# Altium project STB_LightBoard.PrjPcb (part 3 of 10)

## Sheet STB_Driver_ISL78171.SchDoc: STB Light Board - Driver
size A4; Author: flmoll; DrawnBy: flmoll; Organization: PBL; Revision: A; SheetNumber: 4; SheetTotal: 21
Used 28 times, as channels LG/D26, LIR1/D15, LIR1/D16, LIR1/D17, LIR1/D18, LIR2/D19, LIR2/D20, LIR3/D21, LIR3/D22, LIR3/D23, LIR3/D24, LW2/D10, LW2/D11, LW2/D12, LW2/D13, LW2/D14, LW1/D0, LW1/D1, LW1/D2, LW1/D3, LW1/D5, LW1/D6, LW1/D7, LW1/D4, LW1/D9, LW1/D8, LR/D27, LB/D25. Parts and nets are listed once, with the designators drawn on the sheet.
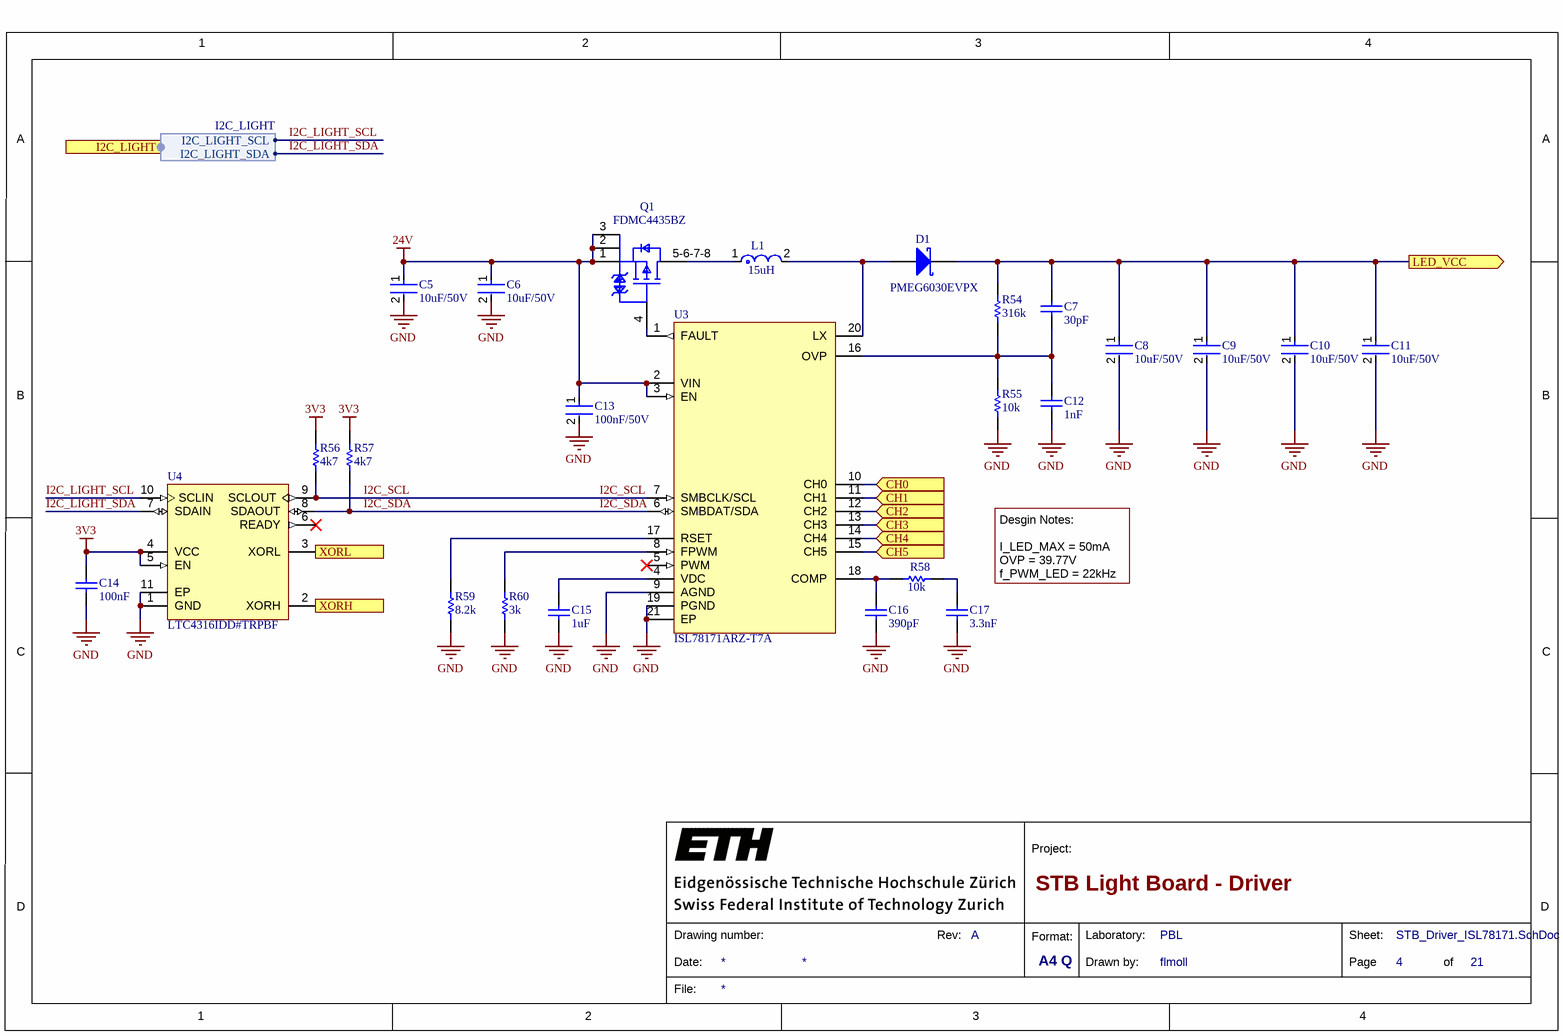
[diagram p4: STB_Driver_ISL78171.SchDoc]

### Parts
C5  10uF/50V  [FP-CL31B106KBHNNNE-MFG]
C6  10uF/50V  [FP-CL31B106KBHNNNE-MFG]
C7  30pF  [CAPC1005X56X25LL10T15]
C8  10uF/50V  [FP-CL31B106KBHNNNE-MFG]
C9  10uF/50V  [FP-CL31B106KBHNNNE-MFG]
C10  10uF/50V  [FP-CL31B106KBHNNNE-MFG]
C11  10uF/50V  [FP-CL31B106KBHNNNE-MFG]
C12  1nF  [CAPC1005X55X25LL5T10]
C13  100nF/50V  [FP-CL10-0_1-MFG]
C14  100nF  [CAPC1050X55X23LL05T13]
C15  1uF  [CAPC1608X90X35LL15T15]
C16  390pF  [CAPC1005X56X25LL10T15]
C17  3.3nF  [CAPC1005X56X25LL10T15]
D1  PMEG6030EVPX  [SOD-128]
L1  15uH  [FP-XAL6060-MFG]
Q1  FDMC4435BZ  [FP-511DQ-MFG]
R54  316k  [RESC1005X40X25LL05T05]
R55  10k  [RESC1005X40X25LL05T05]
R56  4k7  [RESC1005X40X25LL05T10]
R57  4k7  [RESC1005X40X25LL05T10]
R58  10k  [RESC1005X40X25LL05T05]
R59  8.2k  [RESC1005X40X25LL05T05]
R60  3k  [RESC1005X40X25LL05T10]
U3  ISL78171ARZ-T7A  [LT-UDC-20_N]
U4  LTC4316IDD#TRPBF  [DFN10(3x3)_N]

### Ports
CH0 (in, see LED_Driver_NF2W757GT-F1[2A]), CH1 (in, see LED_Driver_NF2W757GT-F1[2A]), CH2 (in, see LED_Driver_NF2W757GT-F1[2A]), CH3 (in, see LED_Driver_NF2W757GT-F1[2B]), CH4 (in, see LED_Driver_NF2W757GT-F1[2B]), CH5 (in, see LED_Driver_NF2W757GT-F1[2B]), I2C_LIGHT (harness I2C_LIGHT, see LED_Driver_NF2W757GT-F1[1A], LED_Driver_AREM-80C0[1A], LED_Driver_AREM-90C0[1A], LED_Driver_NE2B757GT[2B], LED_Driver_NE2G757GT[2B], LED_Driver_NE2R757GT-P6[2B], LED_Driver_NF2L757GT-F1[1A], LED_Driver_NF2W757GT-F1[1A], LED_Driver_QBHP686[1A], STB_FanControl[1A], STB_UID[1A]), LED_VCC (out, see LED_Driver_NF2W757GT-F1[2A]), XORH (see LED_Driver_NF2W757GT-F1[1B]), XORL (see LED_Driver_NF2W757GT-F1[1A])

### Harnesses
I2C_LIGHT: I2C_LIGHT_SDA, I2C_LIGHT_SCL

### Nets
3V3: C14.2 R56.2 R57.2 U4.4(VCC) U4.5(EN)
24V: C5.1 C6.1 C13.1 Q1.1(S) Q1.2(S) Q1.3(S) U3.2(VIN) U3.3(EN)
GND: C5.2 C6.2 C8.2 C9.2 C10.2 C11.2 C12.1 C13.2 C14.1 C15.1 C16.1 C17.1 R55.2 R59.1 R60.1 U3.9(AGND) U3.19(PGND) U3.21(EP) U4.1(GND) U4.11(EP)
CH0: U3.10(CH0) ; port CH0
CH1: U3.11(CH1) ; port CH1
CH2: U3.12(CH2) ; port CH2
CH3: U3.13(CH3) ; port CH3
CH4: U3.14(CH4) ; port CH4
CH5: U3.15(CH5) ; port CH5
I2C_LIGHT_SCL: U4.10(SCLIN) ; port I2C_LIGHT.I2C_LIGHT_SCL
I2C_LIGHT_SDA: U4.7(SDAIN) ; port I2C_LIGHT.I2C_LIGHT_SDA
I2C_SCL: R56.1 U3.7(SMBCLK/SCL) U4.9(SCLOUT)
I2C_SDA: R57.1 U3.6(SMBDAT/SDA) U4.8(SDAOUT)
LED_VCC: C7.2 C8.1 C9.1 C10.1 C11.1 D1.1(K) R54.2 ; port LED_VCC
XORH: U4.2(XORH) ; port XORH
XORL: U4.3(XORL) ; port XORL
NetC7_1: C7.1 C12.2 R54.1 R55.1 U3.16(OVP)
NetC15_2: C15.2 U3.4(VDC)
NetC16_2: C16.2 R58.2 U3.18(COMP)
NetC17_2: C17.2 R58.1
NetD1_2: D1.2(A) L1.2 U3.20(LX)
NetL1_1: L1.1 Q1.5-6-7-8(D)
NetQ1_4: Q1.4(G) U3.1(FAULT)
NetR59_2: R59.2 U3.17(RSET)
NetR60_2: R60.2 U3.8(FPWM)

Not connected (* = marked no-connect by the designer): U3 5(PWM)*; U4 6(READY)*

### Channels
LG/D26: designators end in _D26; ports CH0=NetLED89_g_10_1 CH1=NetLED89_g_11_1 CH2=NetLED89_g_12_1 CH3=NetLED89_g_13_1 CH4=NetLED89_g_14_1 CH5=NetLED89_g_15_1 LED_VCC=NetC7_D26_2 XORH=NetR87_1 XORL=NetR85_1
LIR1/D15: designators end in _D15; ports CH0=NetLED64_IR740_10_1 CH1=NetLED64_IR740_11_1 CH2=NetLED64_IR740_12_1 CH3=NetLED64_IR740_13_1 CH4=NetLED64_IR740_14_1 CH5=NetLED64_IR740_15_1 LED_VCC=NetC7_D15_2 XORH=GND XORL=NetR2_1
LIR1/D16: designators end in _D16; ports CH0=NetLED64_IR740_20_1 CH1=NetLED64_IR740_21_1 CH2=NetLED64_IR740_22_1 CH3=NetLED64_IR740_23_1 CH4=NetLED64_IR740_24_1 CH5=NetLED64_IR740_25_1 LED_VCC=NetC7_D16_2 XORH=NetR7_1 XORL=GND
LIR1/D17: designators end in _D17; ports CH0=NetLED64_IR740_30_1 CH1=NetLED64_IR740_31_1 CH2=NetLED64_IR740_32_1 CH3=NetLED64_IR740_33_1 CH4=NetLED64_IR740_34_1 CH5=NetLED64_IR740_35_1 LED_VCC=NetC7_D17_2 XORH=NetR8_1 XORL=NetR3_1
LIR1/D18: designators end in _D18; ports CH0=NetLED64_IR740_40_1 CH1=NetLED64_IR740_41_1 CH2=NetLED64_IR740_42_1 CH3=NetLED64_IR740_43_1 CH4=NetLED64_IR740_44_1 CH5=NetLED64_IR740_45_1 LED_VCC=NetC7_D18_2 XORH=NetR6_1 XORL=NetR1_1
LIR2/D19: designators end in _D19; ports CH0=NetLED129_IR850_10_1 CH1=NetLED129_IR850_11_1 CH2=NetLED129_IR850_12_1 CH3=NetLED129_IR850_13_1 CH4=NetLED129_IR850_14_1 CH5=NetLED129_IR850_15_1 LED_VCC=NetC7_D19_2 XORH=NetR65_1 XORL=NetR61_1
LIR2/D20: designators end in _D20; ports CH0=NetLED129_IR850_20_1 CH1=NetLED129_IR850_21_1 CH2=NetLED129_IR850_22_1 CH3=NetLED129_IR850_23_1 CH4=NetLED129_IR850_24_1 CH5=NetLED129_IR850_25_1 LED_VCC=NetC7_D20_2 XORH=NetR66_1 XORL=NetR62_1
LIR3/D21: designators end in _D21; ports CH0=NetLED41_IR940_10_1 CH1=NetLED41_IR940_11_1 CH2=NetLED41_IR940_12_1 CH3=NetLED41_IR940_13_1 CH4=NetLED41_IR940_14_1 CH5=NetLED41_IR940_15_1 LED_VCC=NetC7_D21_2 XORH=NetR78_1 XORL=NetR70_1
LIR3/D22: designators end in _D22; ports CH0=NetLED41_IR940_20_1 CH1=NetLED41_IR940_21_1 CH2=NetLED41_IR940_22_1 CH3=NetLED41_IR940_23_1 CH4=NetLED41_IR940_24_1 CH5=NetLED41_IR940_25_1 LED_VCC=NetC7_D22_2 XORH=NetR79_1 XORL=NetR71_1
LIR3/D23: designators end in _D23; ports CH0=NetLED41_IR940_30_1 CH1=NetLED41_IR940_31_1 CH2=NetLED41_IR940_32_1 CH3=NetLED41_IR940_33_1 CH4=NetLED41_IR940_34_1 CH5=NetLED41_IR940_35_1 LED_VCC=NetC7_D23_2 XORH=NetR80_1 XORL=NetR72_1
LIR3/D24: designators end in _D24; ports CH0=NetLED41_IR940_40_1 CH1=NetLED41_IR940_41_1 CH2=NetLED41_IR940_42_1 CH3=NetLED41_IR940_43_1 CH4=NetLED41_IR940_44_1 CH5=NetLED41_IR940_45_1 LED_VCC=NetC7_D24_2 XORH=NetR77_1 XORL=NetR69_1
LW2/D10: designators end in _D10; ports CH0=NetLED103_W3_10_1 CH1=NetLED103_W3_11_1 CH2=NetLED103_W3_12_1 CH3=NetLED103_W3_13_1 CH4=NetLED103_W3_14_1 CH5=NetLED103_W3_15_1 LED_VCC=NetC7_D10_2 XORH=GND XORL=NetR13_1
LW2/D11: designators end in _D11; ports CH0=NetLED103_W3_20_1 CH1=NetLED103_W3_21_1 CH2=NetLED103_W3_22_1 CH3=NetLED103_W3_23_1 CH4=NetLED103_W3_24_1 CH5=NetLED103_W3_25_1 LED_VCC=NetC7_D11_2 XORH=GND XORL=NetR14_1
LW2/D12: designators end in _D12; ports CH0=NetLED103_W3_30_1 CH1=NetLED103_W3_31_1 CH2=NetLED103_W3_32_1 CH3=NetLED103_W3_33_1 CH4=NetLED103_W3_34_1 CH5=NetLED103_W3_35_1 LED_VCC=NetC7_D12_2 XORH=GND XORL=NetR15_1
LW2/D13: designators end in _D13; ports CH0=NetLED103_W3_40_1 CH1=NetLED103_W3_41_1 CH2=NetLED103_W3_42_1 CH3=NetLED103_W3_43_1 CH4=NetLED103_W3_44_1 CH5=NetLED103_W3_45_1 LED_VCC=NetC7_D13_2 XORH=GND XORL=NetR12_1
LW2/D14: designators end in _D14; ports CH0=NetLED103_W3_50_1 CH1=NetLED103_W3_51_1 CH2=NetLED103_W3_52_1 CH3=NetLED103_W3_53_1 CH4=NetLED103_W3_54_1 CH5=NetLED103_W3_55_1 LED_VCC=NetC7_D14_2 XORH=GND XORL=NetR20_1
LW1/D0: designators end in _D0; ports CH0=NetLED77_W5_10_1 CH1=NetLED77_W5_11_1 CH2=NetLED77_W5_12_1 CH3=NetLED77_W5_13_1 CH4=NetLED77_W5_14_1 CH5=NetLED77_W5_15_1 LED_VCC=NetC7_D0_2 XORH=GND XORL=GND
LW1/D1: designators end in _D1; ports CH0=NetLED77_W5_20_1 CH1=NetLED77_W5_21_1 CH2=NetLED77_W5_22_1 CH3=NetLED77_W5_23_1 CH4=NetLED77_W5_24_1 CH5=NetLED77_W5_25_1 LED_VCC=NetC7_D1_2 XORH=GND XORL=NetR23_1
LW1/D2: designators end in _D2; ports CH0=NetLED77_W5_30_1 CH1=NetLED77_W5_31_1 CH2=NetLED77_W5_32_1 CH3=NetLED77_W5_33_1 CH4=NetLED77_W5_34_1 CH5=NetLED77_W5_35_1 LED_VCC=NetC7_D2_2 XORH=GND XORL=NetR24_1
LW1/D3: designators end in _D3; ports CH0=NetLED77_W5_40_1 CH1=NetLED77_W5_41_1 CH2=NetLED77_W5_42_1 CH3=NetLED77_W5_43_1 CH4=NetLED77_W5_44_1 CH5=NetLED77_W5_45_1 LED_VCC=NetC7_D3_2 XORH=GND XORL=NetR22_1
LW1/D5: designators end in _D5; ports CH0=NetLED77_W5_60_1 CH1=NetLED77_W5_61_1 CH2=NetLED77_W5_62_1 CH3=NetLED77_W5_63_1 CH4=NetLED77_W5_64_1 CH5=NetLED77_W5_65_1 LED_VCC=NetC7_D5_2 XORH=GND XORL=NetR30_1
LW1/D6: designators end in _D6; ports CH0=NetLED77_W5_70_1 CH1=NetLED77_W5_71_1 CH2=NetLED77_W5_72_1 CH3=NetLED77_W5_73_1 CH4=NetLED77_W5_74_1 CH5=NetLED77_W5_75_1 LED_VCC=NetC7_D6_2 XORH=GND XORL=NetR31_1
LW1/D7: designators end in _D7; ports CH0=NetLED77_W5_80_1 CH1=NetLED77_W5_81_1 CH2=NetLED77_W5_82_1 CH3=NetLED77_W5_83_1 CH4=NetLED77_W5_84_1 CH5=NetLED77_W5_85_1 LED_VCC=NetC7_D7_2 XORH=GND XORL=NetR28_1
LW1/D4: designators end in _D4; ports CH0=NetLED77_W5_50_1 CH1=NetLED77_W5_51_1 CH2=NetLED77_W5_52_1 CH3=NetLED77_W5_53_1 CH4=NetLED77_W5_54_1 CH5=NetLED77_W5_55_1 LED_VCC=NetC7_D4_2 XORH=GND XORL=NetR29_1
LW1/D9: designators end in _D9; ports CH0=NetLED77_W5_A0_1 CH1=NetLED77_W5_A1_1 CH2=NetLED77_W5_A2_1 CH3=NetLED77_W5_A3_1 CH4=NetLED77_W5_A4_1 CH5=NetLED77_W5_A5_1 LED_VCC=NetC7_D9_2 XORH=GND XORL=NetR37_1
LW1/D8: designators end in _D8; ports CH0=NetLED77_W5_90_1 CH1=NetLED77_W5_91_1 CH2=NetLED77_W5_92_1 CH3=NetLED77_W5_93_1 CH4=NetLED77_W5_94_1 CH5=NetLED77_W5_95_1 LED_VCC=NetC7_D8_2 XORH=GND XORL=NetR36_1
LR/D27: designators end in _D27; ports CH0=NetLED134_r_10_1 CH1=NetLED134_r_11_1 CH2=NetLED134_r_12_1 CH3=NetLED134_r_13_1 CH4=NetLED134_r_14_1 CH5=NetLED134_r_15_1 LED_VCC=NetC7_D27_2 XORH=NetR91_1 XORL=NetR89_1
LB/D25: designators end in _D25; ports CH0=NetLED148_b_10_1 CH1=NetLED148_b_11_1 CH2=NetLED148_b_12_1 CH3=NetLED148_b_13_1 CH4=NetLED148_b_14_1 CH5=NetLED148_b_15_1 LED_VCC=NetC7_D25_2 XORH=NetR42_1 XORL=NetR40_1

### Notes on the sheet
- Desgin Notes:
  I_LED_MAX = 50mA
  OVP = 39.77V
  f_PWM_LED = 22kHz
- 1
- 2
- 3
- 4
- A
- B
- C
- Project:
- D
- Date:
- Drawing number:
- Rev:
- Format:
- A4 Q
- Drawn by:
- Laboratory:
- Page
- Sheet:
- of
- File:

### Library data of the parts
C5 C6 C8-C11 = CMP-2000-07530-2: CAP CER 10UF 50V X7R 1206; Manufacturer: Samsung; Manufacturer Part Number: CL31B106KBHNNNE; Tolerance: 10%; Material: Ceramic; Temperature Coefficient: 15%; Multilayer: Yes; Temperature Characteristic: X7R; Digikey Description: CAP CER 10UF 50V X7R 1206; Device Class L1: Passive Components; Value: 10uF; Lead Free: Yes; Device Class L3: Ceramic Capacitors; Octopart: https://octopart.com/cl31b106kbhnnne-samsung-30507377; ComponentLink2URL: http://www.samsungsem.com/global/front/downloadcms.do?path=%2F%2Fglobal%2F%2Fsupport%2F%2Fproduct-search%2F%2Fmlcc%2F%2F__icsFiles%2F%2Fafieldfile%2F%2F2019%2F%2F06%2F%2F18&fileName=CL31B106KBHNNNE-19.pdf; Voltage Rating: 50V; Temperature Range Low: -55°C; RoHS: TRUE; Temperature: -55°C to +125°C; Category: Cap; ComponentLink2Description: Datasheet; Automotive: No; Device Class L2: Capacitors; Capacitance: 10uF; Height: 1.8mm; Temperature Range High: +125°C; Package: CL31B106KBHNNNE; Supplier 1: Digi-Key; Supplier Part Number 1: 1276-6767-6-ND; Stock 1: 1900998; Pricing 1: 1=0.33000, 10=0.22700, 50=0.15920, 100=0.13650, 500=0.10236, 1000=0.08643 (USD); Mount: Surface Mount; Number of Pins: 2; Dielectric Material: Ceramic; Terminal Finish: Nickel; Size Code: 1206; Package Shape: Rectangular; Min Operating Temperature: -55°C; Max Operating Temperature: 125°C; Capacitor Type: Ceramic; Negative Tolerance: 10%; Positive Tolerance: 10%; Rated DC Voltage (URdc): 50V; Termination: Wraparound; Package Style: SMTMeter; Packaging: Tape and Reel; JESD-609 Code: e3; Temperature Characteristics Code: X7R; Length: 3.2mm; Width: 1.6mm; REACH SVHC: Yes; RoHS Compliant: Yes; ComponentLink1URL: https://datasheet.ciiva.com:443/pdfs/VipMasterIC/IC/SEMS/SEMS-S-A0008524842/SEMS-S-A0008524770-1.pdf?src-supplier=IHS+Markit; ComponentLink1Description: https://datasheet.ciiva.com:443/pdfs/VipMasterIC/IC/SEMS/SEMS-S-A0008524842/SEMS-S-A0008524770-1.pdf?src-supplier=IHS+Markit; ComponentLink3URL: http://www.samsungsem.com/kr/support/product-search/mlcc/CL31B106KBHNNNE.jsp?src-supplier=Digi-Key; ComponentLink3Description: http://www.samsungsem.com/kr/support/product-search/mlcc/CL31B106KBHNNNE.jsp?src-supplier=Digi-Key
C7 = CMP-2008-02634-1: Part Number: 04025A300JAT2A; Manufacturer: AVX Interconnect / Elco; Dielectric Material: Ceramic; Multilayer: Yes; Negative Tolerance: 5%; Rated DC Voltage (URdc): 50V; Temperature Characteristics Code: C0G; Supplier 1: Digi-Key; Supplier Part Number 1: 478-10097-1-ND; Manufacturer Part Number: 04025A300JAT2A; RoHS: Yes; Category: Ceramic Capacitors; Stock 1: 53990; Pricing 1: 1=0.22000, 10=0.15200, 50=0.09080, 100=0.07680, 500=0.05252, 1000=0.04646, 2500=0.04444, 5000=0.04040 (USD); Mount: Surface Mount; Number of Pins: 2; Size Code: 0402; Terminal Finish: Nickel; Package Shape: Rectangular; Min Operating Temperature: -55°C; Max Operating Temperature: 125°C; JESD-609 Code: e3; Value: 30 pF; Capacitor Type: Ceramic; Packaging: Tape and Reel; Positive Tolerance: 5%; Termination: Wraparound; Reach SVHC Compliant: Yes; RoHS Compliant: Yes; ComponentLink1URL: https://datasheet.ciiva.com:443/pdfs/VipMasterIC/IC/AVXC/AVXCS07796/AVXCS07796-1.pdf?src-supplier=IHS+Markit; ComponentLink1Description: https://datasheet.ciiva.com:443/pdfs/VipMasterIC/IC/AVXC/AVXCS07796/AVXCS07796-1.pdf?src-supplier=IHS+Markit; ComponentLink2URL: https://datasheet.ciiva.com/205/ccog-205474.pdf?src-supplier=Digi-Key; ComponentLink2Description: https://datasheet.ciiva.com/205/ccog-205474.pdf?src-supplier=Digi-Key; ComponentLink3URL: https://datasheet.ciiva.com/5424/ccog-243403-5424903.pdf?src-supplier=Mouser; ComponentLink3Description: https://datasheet.ciiva.com/5424/ccog-243403-5424903.pdf?src-supplier=Mouser
C12 = CMP-1662-00017-1: Chip Capacitor, 1 nF, +/- 10%, 50 V, -55 to 125 degC, 0402 (1005 Metric), RoHS, Tape and Reel; Manufacturer: Murata; Manufacturer Part Number: GRM155R71H102KA01D; Case\/Package: 0402; Type (Capacitors): X7R; Voltage Rating (DC): 50 V; Dielectric Material: Ceramic; Multilayer: Yes; Rated DC Voltage (URdc): 50V; Width: 0.5 mm; Pins: 2; REACH SVHC: No SVHC; Length: 1 mm; Height: 0.5 mm; PackageDescription: 2-Pin Surface Mount Device, Body 1 x 0.5 mm; DatasheetVersion: 07/2016; Mount: Surface Mount; ComponentLink2Description: Datasheet; Tolerance: 10%; ComponentLink2URL: http://psearch.en.murata.com/capacitor/product/GRM155R71H102KA01%23.pdf; ComponentLink1URL: http://www.murata.com/; Case Code (Metric): 1005; Package Quantity: 10000; Min Operating Temperature: -55 degC; Max Operating Temperature: 125 degC; Value: 1 nF; Voltage Rating: 50 V; ComponentLink1Description: Manufacturer URL; Packaging: Tape and Reel; Radiation Hardening: No; RoHSCompliant: true; PackageReference: 0402; Mounting Technology: Surface Mount; Case Code (Imperial): 0402; Supplier 1: Digi-Key; Supplier Part Number 1: 490-1303-6-ND; RoHS: Yes; Category: Ceramic Capacitors; Stock 1: 9070370; Pricing 1: 1=0.10000, 10=0.01800, 50=0.01000, 100=0.00810, 500=0.00578, 1000=0.00454, 2500=0.00412, 5000=0.00380 (USD); Number of Pins: 2; Package Shape: Rectangular; Size Code: 0402; Terminal Finish: Nickel; JESD-609 Code: e3; Capacitor Type: Ceramic; Negative Tolerance: 10%; Package Style: SMTMeter; Positive Tolerance: 10%; Temperature Characteristics Code: X7R; Termination: Wraparound; Reach SVHC Compliant: Yes; RoHS Compliant: Yes; ComponentLink3URL: https://datasheet.ciiva.com:443/pdfs/VipMasterIC/IC/MURE/MURE-S-A0008911154/MURE-S-A0008911121-1.pdf?src-supplier=IHS+Markit; ComponentLink3Description: https://datasheet.ciiva.com:443/pdfs/VipMasterIC/IC/MURE/MURE-S-A0008911154/MURE-S-A0008911121-1.pdf?src-supplier=IHS+Markit
C13 = CMP-13271-000011-1: CAP CER 0.1UF 50V X7R 0603; Manufacturer: Samsung Electro-Mechanics America, Inc; Manufacturer Part Number: CL10B104JB8NNNC; Value: 100nF; Material: Ceramic; Temperature Coefficient: 15%; Tolerance: 5%; Multilayer: Yes; Ipc Land Pattern Name: CAPC16080X80; Device Class L1: Passive Components; Digikey Description: CAP CER 0.1UF 50V X7R 0603; Voltage Rating: 50V; Height: 0.9mm; ComponentLink2Description: Datasheet; Device Class L2: Capacitors; ComponentLink2URL: http://www.samsungsem.com/kr/support/product-search/mlcc/__icsFiles/afieldfile/2019/06/18/CL10B104JB8NNNC-19.pdf; Temperature Characteristic: X7R; Temperature Range High: +125°C; Lead Free: Yes; Temperature Range Low: -55°C; Category: Cap; Package: CL10-0.1; Temperature: -55°C to +125°C; Octopart: https://octopart.com/cl10b104jb8nnnc-samsung-9302151; Device Class L3: Ceramic Capacitors; RoHS: TRUE; Automotive: No; Capacitance: 100nF; Supplier 1: Digi-Key; Supplier Part Number 1: 1276-1033-1-ND; Stock 1: 1084419; Pricing 1: 1=0.10000, 10=0.03900, 50=0.02120, 100=0.01740, 500=0.01240, 1000=0.00975 (USD); Mount: Surface Mount; Number of Pins: 2; Dielectric Material: Ceramic; Package Shape: Rectangular; Size Code: 0603; Terminal Finish: Nickel; Min Operating Temperature: -55°C; Max Operating Temperature: 125°C; JESD-609 Code: e3; Capacitor Type: Ceramic; Negative Tolerance: 5%; Package Style: SMTMeter; Packaging: Tape and Reel; Positive Tolerance: 5%; Rated DC Voltage (URdc): 50V; Temperature Characteristics Code: X7R; Termination: Wraparound; Length: 1.6mm; Width: 0.8mm; REACH SVHC: Yes; RoHS Compliant: Yes; ComponentLink1URL: https://datasheet.ciiva.com:443/pdfs/VipMasterIC/IC/SEMS/SEMS-S-A0008384515/SEMS-S-A0008873313-1.pdf?src-supplier=IHS+Markit; ComponentLink1Description: https://datasheet.ciiva.com:443/pdfs/VipMasterIC/IC/SEMS/SEMS-S-A0008384515/SEMS-S-A0008873313-1.pdf?src-supplier=IHS+Markit; ComponentLink3URL: https://datasheet.ciiva.com/25793/cl10b104jb8nnnc-25793394.pdf?src-supplier=Digi-Key; ComponentLink3Description: https://datasheet.ciiva.com/25793/cl10b104jb8nnnc-25793394.pdf?src-supplier=Digi-Key; ComponentLink4URL: https://datasheet.ciiva.com/16498/cl10b104jb8nnnc-16498485.pdf?src-supplier=Future+Electronics; ComponentLink4Description: https://datasheet.ciiva.com/16498/cl10b104jb8nnnc-16498485.pdf?src-supplier=Future+Electronics; ComponentLink5URL: https://datasheet.ciiva.com/26838/getdatasheetpartid-359321-26838402.pdf?src-supplier=Verical; ComponentLink5Description: https://datasheet.ciiva.com/26838/getdatasheetpartid-359321-26838402.pdf?src-supplier=Verical; ComponentLink6URL: https://datasheet.ciiva.com/29199/456613-da-01-en-vs-kondensator-0603-29199008.pdf?src-supplier=Conrad; ComponentLink6Description: https://datasheet.ciiva.com/29199/456613-da-01-en-vs-kondensator-0603-29199008.pdf?src-supplier=Conrad
C14 = CMP-2000-05439-1: Chip Capacitor, 100 nF, +/- 10%, 16 V, -55 to 125 degC, 0402 (1005 Metric), RoHS, Tape and Reel; Manufacturer: Samsung Electro-Mechanics; Manufacturer Part Number: CL05B104KO5NNNC; Dielectric: X7R; Rated Voltage: 16V; Dielectric Material: Ceramic; Multilayer: Yes; Case Size/Dimension: 0402; Tolerance (%): ±10%; Value: 100nF; Manufacturer URL: http://www.samsungsem.com/global/index.jsp; Datasheet URL: https://datasheet.ciiva.com/29198/458718-da-01-en-vs-kondensator-0402-29198423.pdf; Datasheet Version: Nov-10; Supplier 1: Digi-Key; Supplier Part Number 1: 1276-1001-6-ND; RoHS: Yes; Category: Ceramic Capacitors; Stock 1: 24854634; Pricing 1: 1=0.10000, 10=0.02400, 50=0.01300, 100=0.01050, 500=0.00752, 1000=0.00592, 2500=0.00538, 5000=0.00495 (USD); Mount: Surface Mount; Number of Pins: 2; Package Shape: Rectangular; Size Code: 0402; Terminal Finish: Nickel; Min Operating Temperature: -55°C; Max Operating Temperature: 125°C; JESD-609 Code: e3; Capacitor Type: Ceramic; Negative Tolerance: 10%; Packaging: Tape and Reel; Positive Tolerance: 10%; Rated DC Voltage (URdc): 16V; Temperature Characteristics Code: X7R; Termination: Wraparound; Package Style: SMTMeter; Length: 1mm; Width: 0.5mm; Height: 0.55mm; REACH SVHC: Yes; RoHS Compliant: Yes; ComponentLink1URL: https://datasheet.ciiva.com:443/pdfs/VipMasterIC/IC/SEMS/SEMS-S-A0008384515/SEMS-S-A0008872921-1.pdf?src-supplier=IHS+Markit; ComponentLink1Description: https://datasheet.ciiva.com:443/pdfs/VipMasterIC/IC/SEMS/SEMS-S-A0008384515/SEMS-S-A0008872921-1.pdf?src-supplier=IHS+Markit; ComponentLink2URL: https://datasheet.ciiva.com/26920/getdatasheetpartid-359683-26920169.pdf?src-supplier=Verical; ComponentLink2Description: https://datasheet.ciiva.com/26920/getdatasheetpartid-359683-26920169.pdf?src-supplier=Verical; ComponentLink3URL: https://datasheet.ciiva.com/29198/458718-da-01-en-vs-kondensator-0402-29198423.pdf?src-supplier=Conrad; ComponentLink3Description: https://datasheet.ciiva.com/29198/458718-da-01-en-vs-kondensator-0402-29198423.pdf?src-supplier=Conrad; ComponentLink4URL: https://datasheet.ciiva.com/26309/mlcc-catalogdownload2013-eng-26309003.pdf?src-supplier=Distrelec; ComponentLink4Description: https://datasheet.ciiva.com/26309/mlcc-catalogdownload2013-eng-26309003.pdf?src-supplier=Distrelec; ComponentLink5URL: https://datasheet.ciiva.com/16208/cl05b104kq5nnnc-16208343.pdf?src-supplier=Future+Electronics; ComponentLink5Description: https://datasheet.ciiva.com/16208/cl05b104kq5nnnc-16208343.pdf?src-supplier=Future+Electronics
C15 = CMP-2006-02298-2: Manufacturer: Kemet; Part Number: C0603C105K4RACTU; Dielectric Material: Ceramic; Multilayer: Yes; Negative Tolerance: 10%; Rated DC Voltage (URdc): 16V; Temperature Characteristics Code: X7R; Supplier 1: Digi-Key; Supplier Part Number 1: 399-C0603C105K4RAC7867DKR-ND; Manufacturer Part Number: C0603C105K4RACTU; RoHS: Yes; Category: Ceramic Capacitors; Stock 1: 1549593; Pricing 1: 1=0.10000, 10=0.07700, 50=0.04180, 100=0.03410, 500=0.02440, 1000=0.01916 (USD); Mount: Surface Mount; Number of Pins: 2; Package Shape: Rectangular; Size Code: 0603; Terminal Finish: Nickel; Min Operating Temperature: -55°C; Max Operating Temperature: 125°C; Value: 1uF; Capacitor Type: Ceramic; Packaging: Tape and Reel; Positive Tolerance: 10%; Termination: Wraparound; JESD-609 Code: e3; Package Style: SMTMeter; Length: 1.6mm; Width: 0.8mm; Height: 0.8mm; REACH SVHC: Yes; RoHS Compliant: Yes; ComponentLink1URL: https://datasheet.ciiva.com:443/pdfs/VipMasterIC/IC/KEME/KEME-S-A0008991654/KEME-S-A0008991654-1.pdf?src-supplier=IHS+Markit; ComponentLink1Description: https://datasheet.ciiva.com:443/pdfs/VipMasterIC/IC/KEME/KEME-S-A0008991654/KEME-S-A0008991654-1.pdf?src-supplier=IHS+Markit
C16 = CMP-2008-02723-1: Manufacturer: AVX Interconnect / Elco; Part Number: 04025C391JAT2A; Dielectric Material: Ceramic; Multilayer: Yes; Negative Tolerance: 5%; Rated DC Voltage (URdc): 50V; Temperature Characteristics Code: X7R; Supplier 1: Digi-Key; Supplier Part Number 1: 478-5269-6-ND; Manufacturer Part Number: 04025C391JAT2A; RoHS: Yes; Category: Ceramic Capacitors; Stock 1: 11766; Pricing 1: 1=0.34000, 10=0.23000, 50=0.15360, 100=0.13050, 500=0.09212, 1000=0.08060, 2500=0.07676, 5000=0.07100 (USD); Mount: Surface Mount; Number of Pins: 2; Size Code: 0402; Terminal Finish: Nickel; Package Shape: Rectangular; Min Operating Temperature: -55°C; Max Operating Temperature: 125°C; Value: 390pF; Capacitor Type: Ceramic; Positive Tolerance: 5%; Packaging: Tape and Reel; JESD-609 Code: e3; Package Style: SMTMeter; Termination: Wraparound; Length: 1mm; Width: 0.5mm; Height: 0.56mm; REACH SVHC: Yes; RoHS Compliant: Yes; ComponentLink1URL: https://datasheet.ciiva.com:443/pdfs/VipMasterIC/IC/AVXC/AVXC-S-A0008668650/AVXC-S-A0008668650-1.pdf?src-supplier=IHS+Markit; ComponentLink1Description: https://datasheet.ciiva.com:443/pdfs/VipMasterIC/IC/AVXC/AVXC-S-A0008668650/AVXC-S-A0008668650-1.pdf?src-supplier=IHS+Markit; ComponentLink2URL: https://datasheet.ciiva.com/152/cx7r-152296.pdf?src-supplier=Digi-Key; ComponentLink2Description: https://datasheet.ciiva.com/152/cx7r-152296.pdf?src-supplier=Digi-Key; ComponentLink3URL: https://datasheet.ciiva.com/152/cx7r-152297.pdf?src-supplier=Digi-Key; ComponentLink3Description: https://datasheet.ciiva.com/152/cx7r-152297.pdf?src-supplier=Digi-Key; ComponentLink4URL: https://datasheet.ciiva.com/152/cx7r-152298.pdf?src-supplier=Digi-Key; ComponentLink4Description: https://datasheet.ciiva.com/152/cx7r-152298.pdf?src-supplier=Digi-Key; ComponentLink5URL: https://datasheet.ciiva.com/16327/cx7r-16327679.pdf?src-supplier=Future+Electronics; ComponentLink5Description: https://datasheet.ciiva.com/16327/cx7r-16327679.pdf?src-supplier=Future+Electronics
C17 = CMP-2008-02533-1: Manufacturer: AVX Interconnect / Elco; Part Number: 04023C332KAT2A; Dielectric Material: Ceramic; Multilayer: Yes; Negative Tolerance: 10%; Rated DC Voltage (URdc): 25V; Temperature Characteristics Code: X7R; Supplier 1: Digi-Key; Supplier Part Number 1: 478-12621-6-ND; Manufacturer Part Number: 04023C332KAT2A; RoHS: Yes; Category: Ceramic Capacitors; Stock 1: 22877; Pricing 1: 1=0.10000, 10=0.03300, 50=0.01820, 100=0.01480, 500=0.01060, 1000=0.00833, 2500=0.00758, 5000=0.00697 (USD); Mount: Surface Mount; Number of Pins: 2; Package Shape: Rectangular; Size Code: 0402; Terminal Finish: Nickel; Min Operating Temperature: -55°C; Max Operating Temperature: 125°C; Value: 3.3nF; Capacitor Type: Ceramic; Packaging: Tape and Reel; Positive Tolerance: 10%; Termination: Wraparound; JESD-609 Code: e3; Package Style: SMTMeter; Length: 1mm; Width: 0.5mm; Height: 0.56mm; Reach SVHC Compliant: Yes; RoHS Compliant: Yes; ComponentLink1URL: https://datasheet.ciiva.com:443/pdfs/VipMasterIC/IC/AVXC/AVXC-S-A0009640452/AVXC-S-A0009640452-1.pdf?src-supplier=IHS+Markit; ComponentLink1Description: https://datasheet.ciiva.com:443/pdfs/VipMasterIC/IC/AVXC/AVXC-S-A0009640452/AVXC-S-A0009640452-1.pdf?src-supplier=IHS+Markit; ComponentLink2URL: https://datasheet.ciiva.com/206/cx7r-206442.pdf?src-supplier=Digi-Key; ComponentLink2Description: https://datasheet.ciiva.com/206/cx7r-206442.pdf?src-supplier=Digi-Key; ComponentLink3URL: https://datasheet.ciiva.com/11578/cx7r-11578284.pdf?src-supplier=Avnet; ComponentLink3Description: https://datasheet.ciiva.com/11578/cx7r-11578284.pdf?src-supplier=Avnet
D1 = CMP-02090-1: Diode Schottky 60 V 3A Surface Mount SOD-128/CFP5; Manufacturer: Nexperia; Application(s): EFFICIENCY; Diode Element Material: SILICON; Diode Type: RECTIFIER; Forward Voltage-Max (VF): 475mV; Max Output Current: 4.2A; Max Power Dissipation: 750mW; Max Reverse Current: 400uA; Non-rep Pk Forward Current-Max: 70A; Number of Elements: 1; Package Body Material: Plastic; Reference Standard: AEC-Q101; Rep Pk Reverse Voltage-Max: 60V; Reverse Recovery Time-Max: 0.02us; Description: Rectifier Diode, Schottky, 1 Phase, 1 Element, 4.2A, 60V V(RRM), Silicon; JESD-30 Code: R-PDSO-F2; Max Operating Temperature: 175°C; Min Operating Temperature: -55°C; Number of Phases: 1; Number of Pins: 2; Package Shape: Rectangular; Package Style: SMALL OUTLINEMeter; REACH SVHC: Yes; RoHS Compliant: Yes; Surface Mount: Yes; Technology: SCHOTTKY; Terminal Form: Flat; Terminal Position: DUAL; Supplier 1: Digi-Key; Supplier Part Number 1: 1727-1349-2-ND; Manufacturer Part Number: PMEG6030EVPX; RoHS: No; Category: Rectifier Diodes; Stock 1: 216000; Pricing 1: 3000=0.17153, 6000=0.16046, 15000=0.15660 (USD); Reach SVHC Compliant: No; ComponentLink1URL: https://datasheet.ciiva.com:443/pdfs/VipMasterIC/IC/NEXP/NEXP-S-A0003060256/NEXP-S-A0003060189-1.pdf?src-supplier=IHS+Markit; ComponentLink1Description: https://datasheet.ciiva.com:443/pdfs/VipMasterIC/IC/NEXP/NEXP-S-A0003060256/NEXP-S-A0003060189-1.pdf?src-supplier=IHS+Markit; ComponentLink2URL: http://www.farnell.com/datasheets/1738907.pdf?src-supplier=Farnell; ComponentLink2Description: http://www.farnell.com/datasheets/1738907.pdf?src-supplier=Farnell; ComponentLink3URL: http://www.farnell.com/datasheets/1738907.pdf?src-supplier=Newark; ComponentLink3Description: http://www.farnell.com/datasheets/1738907.pdf?src-supplier=Newark; ComponentLink4URL: https://assets.nexperia.com/documents/data-sheet/PMEG6030EVP.pdf?src-supplier=Digi-Key; ComponentLink4Description: https://assets.nexperia.com/documents/data-sheet/PMEG6030EVP.pdf?src-supplier=Digi-Key; ComponentLink5URL: http://www.farnell.com/datasheets/1738907.pdf?src-supplier=Element14; ComponentLink5Description: http://www.farnell.com/datasheets/1738907.pdf?src-supplier=Element14
L1 = CMP-11268-000180-1: Power inductor, shielded, 20% tol, SMT, RoHS, halogen, SMD2; Manufacturer: Coilcraft; Manufacturer Part Number: XAL6060-153MEC; Saturation Current: 5.8A; Max DC Current: 6A; Core Material: Composite; Self Resonant Frequency: 11MHz; Test Frequency: 100kHz; DC Resistance (DCR): 43.75mR; Case/Size Code: 2526; Inductor Type: GENERAL PURPOSE INDUCTOR; Number of Functions: 1; Shape/Size Description: RECTANGULAR PACKAGE; Package Height: 6.1mm; Package Length: 6.56mm; Package Width: 6.36mm; Reference Standard: AEC-Q200; Length: 6.76mm; Termination: SMD/SMT; RoHS Compliant: Yes; REACH SVHC: No SVHC; Lead Free: Contains Lead; Height: 6.1mm; Inductance Tolerance: 20%; Series: XAL6060; Package Quantity: 250; Min Operating Temperature: -40°C; Width: 6.56mm; Packaging: Tape and Reel; Inductance: 15uH; Case/Package: SMD/SMT; Max Operating Temperature: 125°C; Mount: Surface Mount; Shielding: Shielded; RMS Current (Irms): 6A; Tolerance: 20%; Supplier 1: Mouser; Supplier Part Number 1: 994-XAL6060-153MEC; RoHS: Yes; Category: Fixed Inductors; Stock 1: 38539; Pricing 1: 1=3.81000, 10=3.81000, 50=3.81000, 100=3.05000, 1000=1.36000, 10000=1.36000 (USD); Number of Pins: 2; Terminal Finish: Tin; JESD-609 Code: e2; Construction: Shielded; Value: 15uH; Inductor Application: POWER INDUCTOR; Package Style: SMTMeter; Rated Current-Max: 6A; Surface Mount: Yes; Terminal Placement: Dual Ended; ComponentLink1URL: https://datasheet.ciiva.com:443/pdfs/VipMasterIC/IC/COLC/COLC-S-A0006757260/COLC-S-A0006757260-1.pdf?src-supplier=IHS+Markit; ComponentLink1Description: https://datasheet.ciiva.com:443/pdfs/VipMasterIC/IC/COLC/COLC-S-A0006757260/COLC-S-A0006757260-1.pdf?src-supplier=IHS+Markit; ComponentLink2URL: https://datasheet.ciiva.com/22680/1681993-22680391.pdf?src-supplier=Element14; ComponentLink2Description: https://datasheet.ciiva.com/22680/1681993-22680391.pdf?src-supplier=Element14; ComponentLink3URL: https://datasheet.ciiva.com/22680/1681993-22680392.pdf?src-supplier=Element14; ComponentLink3Description: https://datasheet.ciiva.com/22680/1681993-22680392.pdf?src-supplier=Element14; ComponentLink4URL: https://datasheet.ciiva.com/22738/1681993-22738318.pdf?src-supplier=Element14; ComponentLink4Description: https://datasheet.ciiva.com/22738/1681993-22738318.pdf?src-supplier=Element14
Q1 = CMP-07173-000045-1: MOSFET P-CH 30V 8.5A POWER33; Manufacturer: ON Semiconductor; Reverse Recovery Charge: 12nC; Reverse Recovery Time: 26ns; Threshold Vgs Min: -1V; Continuous Drain Current: -8.5A; Threshold Vgs Max: -3V; Number Of Channels: 1; Drain To Source Resistance: 14mΩ; Gate Charge At Vgs: 38nC @ -10V; Rthja Max: 53°C/W; Typ Forward Diode Voltage: 0.86V; Turn Off Delay Time: 35ns; Max Forward Diode Voltage: 1.5V; Drain To Source Voltage: -30V; Pulse Drain Current: -50A; Turn On Delay Time: 10ns; Transconductance: 25S; Depletion Mode: False; Gate To Source Voltage: 25V; Standoff Height: 0mm; Max Junction Temp: +150°C; Input Capacitace At Vds: 1535pF @ -15V; Power Dissipation: 2.3W; Manufacturer Part Number: FDMC4435BZ; Footprint Url: https://www.onsemi.com/pub/Collateral/511DQ.PDF; Temperature Range High: +150°C; Device Class L2: Transistors; Mouser Description: MOSFET -30V P-Channel PowerTrench; Lead Free: Yes; Automotive: No; RoHS: TRUE; Temperature Range Low: -55°C; Category: Trans; Temperature: -55°C to +150°C; Digikey Description: MOSFET P-CH 30V 8.5A POWER33; Package: 511DQ; Drain To Source Breakdown Voltage: -30V; Number Of P Channels: 1; Device Class L3: MOSFETs; ComponentLink2URL: https://www.onsemi.com/pub/Collateral/FDMC4435BZ-D.PDF; ComponentLink2Description: Datasheet; Height: 0.8mm; Device Class L1: Discrete Semiconductors; Octopart: https://octopart.com/fdmc4435bz-on+semiconductor-84326033
R54 = CMP-2002-00863-1: Manufacturer: Panasonic; Part Number: ERJ-2RKF3163X; Tolerance: 1%; Rated Power Dissipation (P): 100mW; Value: 316 kOhm; Temperature Coefficient: 100ppm/°C; Working Voltage: 50V; Rated Temperature: 70°C; Package Height: 0.35mm; Package Length: 1mm; Package Width: 0.5mm; Reference Standard: AEC-Q200; Supplier 1: Digi-Key; Supplier Part Number 1: P316KLDKR-ND; Manufacturer Part Number: ERJ-2RKF3163X; RoHS: Yes; Category: Chip SMD Resistors; Stock 1: 215434; Pricing 1: 1=0.10000, 10=0.03300, 100=0.01330, 1000=0.00599, 2500=0.00520, 5000=0.00429 (USD); Mount: Surface Mount; Number of Pins: 2; Size Code: 0402; Terminal Finish: Nickel; Package Shape: Rectangular; Min Operating Temperature: -55°C; Max Operating Temperature: 155°C; Resistor Type: FIXED RESISTOR; Packaging: Tape and Reel; Technology: METAL GLAZE/THICK FILM; JESD-609 Code: e3; Construction: Rectangular; Package Style: SMTMeter; Termination: Wraparound; Reach SVHC Compliant: Yes; RoHS Compliant: Yes; ComponentLink1URL: https://datasheet.ciiva.com:443/pdfs/VipMasterIC/IC/PANA/PANA-S-A0009889626/PANA-S-A0009889626-1.pdf?src-supplier=IHS+Markit; ComponentLink1Description: https://datasheet.ciiva.com:443/pdfs/VipMasterIC/IC/PANA/PANA-S-A0009889626/PANA-S-A0009889626-1.pdf?src-supplier=IHS+Markit; ComponentLink2URL: https://datasheet.ciiva.com/7853/aoa0000ce2-7853694.pdf?src-supplier=Element14; ComponentLink2Description: https://datasheet.ciiva.com/7853/aoa0000ce2-7853694.pdf?src-supplier=Element14; ComponentLink3URL: https://datasheet.ciiva.com/43467/1678782-43467525.pdf?src-supplier=Farnell; ComponentLink3Description: https://datasheet.ciiva.com/43467/1678782-43467525.pdf?src-supplier=Farnell; ComponentLink4URL: https://datasheet.ciiva.com/46373/1678782-46373323.pdf?src-supplier=Element14; ComponentLink4Description: https://datasheet.ciiva.com/46373/1678782-46373323.pdf?src-supplier=Element14; ComponentLink5URL: https://datasheet.ciiva.com/22663/1678782-22663805.pdf?src-supplier=Farnell; ComponentLink5Description: https://datasheet.ciiva.com/22663/1678782-22663805.pdf?src-supplier=Farnell; ComponentLink6URL: https://datasheet.ciiva.com/28564/1694929-28564143.pdf?src-supplier=Element14; ComponentLink6Description: https://datasheet.ciiva.com/28564/1694929-28564143.pdf?src-supplier=Element14; ComponentLink7URL: https://datasheet.ciiva.com/46373/1678782-46373322.pdf?src-supplier=Element14; ComponentLink7Description: https://datasheet.ciiva.com/46373/1678782-46373322.pdf?src-supplier=Element14; ComponentLink8URL: https://datasheet.ciiva.com/24070/aoa0000ce2-24070773.pdf?src-supplier=Mouser; ComponentLink8Description: https://datasheet.ciiva.com/24070/aoa0000ce2-24070773.pdf?src-supplier=Mouser; ComponentLink9URL: https://datasheet.ciiva.com/16761/70260748-16761806.pdf?src-supplier=Allied+Electronics; ComponentLink9Description: https://datasheet.ciiva.com/16761/70260748-16761806.pdf?src-supplier=Allied+Electronics; ComponentLink10URL: https://datasheet.ciiva.com/16762/70260748-16762152.pdf?src-supplier=Allied+Electronics; ComponentLink10Description: https://datasheet.ciiva.com/16762/70260748-16762152.pdf?src-supplier=Allied+Electronics; ComponentLink11URL: https://datasheet.ciiva.com/9183/aoa0000ce2-9183095.pdf?src-supplier=Avnet; ComponentLink11Description: https://datasheet.ciiva.com/9183/aoa0000ce2-9183095.pdf?src-supplier=Avnet; ComponentLink12URL: https://datasheet.ciiva.com/30180/aoa0000ce2-30180486.pdf?src-supplier=Onlinecomponents.com; ComponentLink12Description: https://datasheet.ciiva.com/30180/aoa0000ce2-30180486.pdf?src-supplier=Onlinecomponents.com
R55 R58 = CMP-2000-07588-1: Chip Resistor, 10 KOhm, +/- 1%, 0.1 W, -55 to 155 degC, 0402 (1005 Metric), RoHS, Tape and Reel; Manufacturer: Panasonic; Manufacturer Part Number: ERJ-2RKF1002X; Power Rating: 100mW; Voltage Rating: 50V; Value: 10 kOhm; Case\/Package: 0402; Temperature Coefficient: 100ppm\/degreesC; Rated Temperature: 70°C; Package Height: 0.35mm; Package Length: 1mm; Package Width: 0.5mm; Reference Standard: AEC-Q200; RoHSCompliant: True; Lead Free: LeadFree; Package Quantity: 1; Contact Plating: Tin; Length: 1mm; Radiation Hardening: No; REACH SVHC: NoSVHC; Max Operating Temperature: 155degC; Depth: 0.5mm; Case Code (Imperial): 0402; Military Standard: Not; Package Description: 2-Pin Surface Mount Device, Body 1 x 0.5 mm; Termination: SMD/SMT; Case Code (Metric): 1005; Height: 0.35mm; Packaging: TapeandReel; Voltage Rating (DC): 50V; Package Reference: 402; Number of Pins: 2; Tolerance: 1%; Mounting Technology: SurfaceMount; Width: 0.02inch; Mount: SurfaceMount; Datasheet URL: https://industrial.panasonic.com/cdbs/www-data/pdf/RDA0000/AOA0000C304.pdf; Composition: ThickFilm; Datasheet Version: 02/2017; Manufacturer URL: http://www.panasonic.com/; Max Power Dissipation: 100mW; Number of Terminations: 2; Min Operating Temperature: -55degC; Supplier 1: Digi-Key; Supplier Part Number 1: P10.0KLDKR-ND; RoHS: Yes; Category: Chip SMD Resistors; Stock 1: 108; Pricing 1: 1=0.10000, 10=0.03300, 100=0.01330, 1000=0.00599, 2500=0.00520, 5000=0.00429 (USD); Size Code: 0402; Terminal Finish: Nickel; Package Shape: Rectangular; Resistor Type: FIXED RESISTOR; Rated Power Dissipation (P): 100mW; Technology: METAL GLAZE/THICK FILM; Working Voltage: 50V; Construction: Rectangular; Package Style: SMTMeter; JESD-609 Code: e3; RoHS Compliant: Yes; ComponentLink1URL: https://datasheet.ciiva.com:443/pdfs/VipMasterIC/IC/PANA/PANA-S-A0009889626/PANA-S-A0009889626-1.pdf?src-supplier=IHS+Markit; ComponentLink1Description: https://datasheet.ciiva.com:443/pdfs/VipMasterIC/IC/PANA/PANA-S-A0009889626/PANA-S-A0009889626-1.pdf?src-supplier=IHS+Markit; ComponentLink2URL: https://datasheet.ciiva.com/11821/0900766b80f80784-11821171.pdf?src-supplier=RSComponents; ComponentLink2Description: https://datasheet.ciiva.com/11821/0900766b80f80784-11821171.pdf?src-supplier=RSComponents; ComponentLink3URL: https://datasheet.ciiva.com/27055/1987020-27055643.pdf?src-supplier=Jameco; ComponentLink3Description: https://datasheet.ciiva.com/27055/1987020-27055643.pdf?src-supplier=Jameco; ComponentLink4URL: https://datasheet.ciiva.com/43467/1678782-43467402.pdf?src-supplier=Farnell; ComponentLink4Description: https://datasheet.ciiva.com/43467/1678782-43467402.pdf?src-supplier=Farnell; ComponentLink5URL: https://datasheet.ciiva.com/28514/1678782-28514185.pdf?src-supplier=Element14; ComponentLink5Description: https://datasheet.ciiva.com/28514/1678782-28514185.pdf?src-supplier=Element14; ComponentLink6URL: https://datasheet.ciiva.com/24023/aoa0000ce2-24023017.pdf?src-supplier=Mouser; ComponentLink6Description: https://datasheet.ciiva.com/24023/aoa0000ce2-24023017.pdf?src-supplier=Mouser; ComponentLink7URL: https://datasheet.ciiva.com/16782/70260748-16782590.pdf?src-supplier=Allied+Electronics; ComponentLink7Description: https://datasheet.ciiva.com/16782/70260748-16782590.pdf?src-supplier=Allied+Electronics; ComponentLink8URL: https://datasheet.ciiva.com/16786/70260748-16786734.pdf?src-supplier=Allied+Electronics; ComponentLink8Description: https://datasheet.ciiva.com/16786/70260748-16786734.pdf?src-supplier=Allied+Electronics; ComponentLink9URL: https://datasheet.ciiva.com/9194/aoa0000ce2-9194142.pdf?src-supplier=Avnet; ComponentLink9Description: https://datasheet.ciiva.com/9194/aoa0000ce2-9194142.pdf?src-supplier=Avnet; ComponentLink10URL: https://datasheet.ciiva.com/16199/aoa0000ce2-16199478.pdf?src-supplier=Future+Electronics; ComponentLink10Description: https://datasheet.ciiva.com/16199/aoa0000ce2-16199478.pdf?src-supplier=Future+Electronics; ComponentLink11URL: https://datasheet.ciiva.com/48531/aoa0000ce2-48531069.pdf?src-supplier=Avnet; ComponentLink11Description: https://datasheet.ciiva.com/48531/aoa0000ce2-48531069.pdf?src-supplier=Avnet; ComponentLink12URL: https://datasheet.ciiva.com/30201/aoa0000ce2-30201022.pdf?src-supplier=Onlinecomponents.com; ComponentLink12Description: https://datasheet.ciiva.com/30201/aoa0000ce2-30201022.pdf?src-supplier=Onlinecomponents.com
R56 R57 = CMP-1011-00586-2: Manufacturer: Yageo / Phycomp; Part Number: RC0402FR-074K7L; Tolerance: 1%; Rated Power Dissipation (P): 62.5mW; Rated Temperature: 70°C; Value: 4.7 kOhm; Temperature Coefficient: 100ppm/°C; Working Voltage: 50V; Additional Feature: LASER TRIMMABLE; Package Height: 0.35mm; Package Length: 1mm; Package Width: 0.5mm; Supplier 1: Digi-Key; Supplier Part Number 1: 311-4.7KLRDKR-ND; Manufacturer Part Number: RC0402FR-074K7L; RoHS: Yes; Category: Chip SMD Resistors; Stock 1: 23638739; Pricing 1: 1=0.10000, 10=0.01500, 100=0.00600, 1000=0.00267, 2500=0.00232, 5000=0.00192 (USD); Mount: Surface Mount; Number of Pins: 2; Package Shape: Rectangular; Size Code: 0402; Terminal Finish: Nickel; Min Operating Temperature: -55°C; Max Operating Temperature: 155°C; Resistor Type: FIXED RESISTOR; Packaging: Tape and Reel; Technology: METAL GLAZE/THICK FILM; Termination: Wraparound; JESD-609 Code: e3; Construction: Chip; Package Style: SMTMeter; REACH SVHC: Yes; RoHS Compliant: Yes; ComponentLink1URL: https://datasheet.ciiva.com:443/pdfs/VipMasterIC/IC/YAGO/YAGO-S-A0008145938/YAGO-S-A0008145938-1.pdf?src-supplier=IHS+Markit; ComponentLink1Description: https://datasheet.ciiva.com:443/pdfs/VipMasterIC/IC/YAGO/YAGO-S-A0008145938/YAGO-S-A0008145938-1.pdf?src-supplier=IHS+Markit; ComponentLink2URL: https://datasheet.ciiva.com/22661/1686128-22661342.pdf?src-supplier=Element14; ComponentLink2Description: https://datasheet.ciiva.com/22661/1686128-22661342.pdf?src-supplier=Element14; ComponentLink3URL: https://datasheet.ciiva.com/7850/1018594-7850022.pdf?src-supplier=Element14; ComponentLink3Description: https://datasheet.ciiva.com/7850/1018594-7850022.pdf?src-supplier=Element14; ComponentLink4URL: https://datasheet.ciiva.com/7850/1018594-7850023.pdf?src-supplier=Element14; ComponentLink4Description: https://datasheet.ciiva.com/7850/1018594-7850023.pdf?src-supplier=Element14; ComponentLink5URL: https://datasheet.ciiva.com/15215/getdatasheetpartid-328119-15215035.pdf?src-supplier=Verical; ComponentLink5Description: https://datasheet.ciiva.com/15215/getdatasheetpartid-328119-15215035.pdf?src-supplier=Verical
R59 = CMP-2002-00254-1: Part Number: CRCW04028K20FKED; Manufacturer: Vishay Dale; Tolerance: 1%; Rated Power Dissipation (P): 63mW; Rated Temperature: 70°C; Value: 8.2 kOhm; Temperature Coefficient: 100ppm/°C; Working Voltage: 50V; Package Height: 0.35mm; Package Length: 1mm; Package Width: 0.5mm; Reference Standard: AEC-Q200; Supplier 1: Digi-Key; Supplier Part Number 1: 541-8.20KLCT-ND; Manufacturer Part Number: CRCW04028K20FKED; RoHS: Yes; Category: Chip SMD Resistors; Stock 1: 13746; Pricing 1: 1=0.10000, 10=0.03600, 100=0.01460, 1000=0.00656, 2500=0.00569, 5000=0.00470 (USD); Mount: Surface Mount; Number of Pins: 2; Size Code: 0402; Terminal Finish: Nickel; Package Shape: Rectangular; Min Operating Temperature: -55°C; Max Operating Temperature: 155°C; Resistor Type: FIXED RESISTOR; Construction: Chip; Package Style: SMTMeter; Packaging: Tape and Reel; Technology: METAL GLAZE/THICK FILM; Termination: Wraparound; JESD-609 Code: e3; REACH SVHC: Yes; RoHS Compliant: Yes; ComponentLink1URL: https://datasheet.ciiva.com:443/pdfs/VipMasterIC/IC/VISH/VISH-S-A0007266705/VISH-S-A0007266705-1.pdf?src-supplier=IHS+Markit; ComponentLink1Description: https://datasheet.ciiva.com:443/pdfs/VipMasterIC/IC/VISH/VISH-S-A0007266705/VISH-S-A0007266705-1.pdf?src-supplier=IHS+Markit; ComponentLink2URL: https://datasheet.ciiva.com/11812/0900766b80d98824-11812188.pdf?src-supplier=RSComponents; ComponentLink2Description: https://datasheet.ciiva.com/11812/0900766b80d98824-11812188.pdf?src-supplier=RSComponents; ComponentLink3URL: https://datasheet.ciiva.com/3256/dcrcwe3-3256869.pdf?src-supplier=Avnet; ComponentLink3Description: https://datasheet.ciiva.com/3256/dcrcwe3-3256869.pdf?src-supplier=Avnet; ComponentLink4URL: https://datasheet.ciiva.com/22708/1697337-22708421.pdf?src-supplier=Element14; ComponentLink4Description: https://datasheet.ciiva.com/22708/1697337-22708421.pdf?src-supplier=Element14; ComponentLink5URL: https://datasheet.ciiva.com/7743/125364-7743766.pdf?src-supplier=Element14; ComponentLink5Description: https://datasheet.ciiva.com/7743/125364-7743766.pdf?src-supplier=Element14; ComponentLink6URL: https://datasheet.ciiva.com/5544/dcrcwe3-109170-5544989.pdf?src-supplier=Mouser; ComponentLink6Description: https://datasheet.ciiva.com/5544/dcrcwe3-109170-5544989.pdf?src-supplier=Mouser; ComponentLink7URL: https://datasheet.ciiva.com/22870/70201119-22870317.pdf?src-supplier=Allied+Electronics; ComponentLink7Description: https://datasheet.ciiva.com/22870/70201119-22870317.pdf?src-supplier=Allied+Electronics; ComponentLink8URL: https://datasheet.ciiva.com/7841/1697337-7841551.pdf?src-supplier=Element14; ComponentLink8Description: https://datasheet.ciiva.com/7841/1697337-7841551.pdf?src-supplier=Element14; ComponentLink9URL: https://datasheet.ciiva.com/2495/dcrcwe3-2495081.pdf?src-supplier=Digi-Key; ComponentLink9Description: https://datasheet.ciiva.com/2495/dcrcwe3-2495081.pdf?src-supplier=Digi-Key; ComponentLink10URL: https://datasheet.ciiva.com/16768/70201119-16768637.pdf?src-supplier=Allied+Electronics; ComponentLink10Description: https://datasheet.ciiva.com/16768/70201119-16768637.pdf?src-supplier=Allied+Electronics; ComponentLink11URL: https://datasheet.ciiva.com/7841/1697337-7841550.pdf?src-supplier=Element14; ComponentLink11Description: https://datasheet.ciiva.com/7841/1697337-7841550.pdf?src-supplier=Element14; ComponentLink12URL: https://datasheet.ciiva.com/2495/dcrcwe3-2495080.pdf?src-supplier=Digi-Key; ComponentLink12Description: https://datasheet.ciiva.com/2495/dcrcwe3-2495080.pdf?src-supplier=Digi-Key; ComponentLink13URL: https://datasheet.ciiva.com/26316/fld-crcw-e3-data-en-26316617.pdf?src-supplier=Distrelec; ComponentLink13Description: https://datasheet.ciiva.com/26316/fld-crcw-e3-data-en-26316617.pdf?src-supplier=Distrelec; ComponentLink14URL: https://datasheet.ciiva.com/2495/dcrcwe3-2495082.pdf?src-supplier=Digi-Key; ComponentLink14Description: https://datasheet.ciiva.com/2495/dcrcwe3-2495082.pdf?src-supplier=Digi-Key
R60 = CMP-1011-00562-2: Part Number: RC0402FR-073KL; Manufacturer: Yageo / Phycomp; Tolerance: 1%; Rated Power Dissipation (P): 62.5mW; Rated Temperature: 70°C; Value: 3 kOhm; Temperature Coefficient: 100ppm/°C; Working Voltage: 50V; Additional Feature: LASER TRIMMABLE; Package Height: 0.35mm; Package Length: 1mm; Package Width: 0.5mm; Supplier 1: Digi-Key; Supplier Part Number 1: 311-3KLRDKR-ND; Manufacturer Part Number: RC0402FR-073KL; RoHS: Yes; Category: Chip SMD Resistors; Stock 1: 1276326; Pricing 1: 1=0.10000, 10=0.01500, 100=0.00600, 1000=0.00267, 2500=0.00232, 5000=0.00192 (USD); Mount: Surface Mount; Number of Pins: 2; Size Code: 0402; Terminal Finish: Nickel; Package Shape: Rectangular; Min Operating Temperature: -55°C; Max Operating Temperature: 155°C; Resistor Type: FIXED RESISTOR; Construction: Chip; Package Style: SMTMeter; Technology: METAL GLAZE/THICK FILM; Termination: Wraparound; JESD-609 Code: e3; Packaging: Tape and Reel; Reach SVHC Compliant: Yes; RoHS Compliant: Yes; ComponentLink1URL: https://datasheet.ciiva.com:443/pdfs/VipMasterIC/IC/YAGO/YAGO-S-A0008145938/YAGO-S-A0008145938-1.pdf?src-supplier=IHS+Markit; ComponentLink1Description: https://datasheet.ciiva.com:443/pdfs/VipMasterIC/IC/YAGO/YAGO-S-A0008145938/YAGO-S-A0008145938-1.pdf?src-supplier=IHS+Markit; ComponentLink2URL: https://datasheet.ciiva.com/7849/1018594-7849992.pdf?src-supplier=Element14; ComponentLink2Description: https://datasheet.ciiva.com/7849/1018594-7849992.pdf?src-supplier=Element14; ComponentLink3URL: https://datasheet.ciiva.com/7849/1018594-7849991.pdf?src-supplier=Element14; ComponentLink3Description: https://datasheet.ciiva.com/7849/1018594-7849991.pdf?src-supplier=Element14; ComponentLink4URL: https://datasheet.ciiva.com/2553/pyu-r-int-thick-7-2553255.pdf?src-supplier=Digi-Key; ComponentLink4Description: https://datasheet.ciiva.com/2553/pyu-r-int-thick-7-2553255.pdf?src-supplier=Digi-Key; ComponentLink5URL: https://datasheet.ciiva.com/2553/pyu-r-int-thick-7-2553256.pdf?src-supplier=Digi-Key; ComponentLink5Description: https://datasheet.ciiva.com/2553/pyu-r-int-thick-7-2553256.pdf?src-supplier=Digi-Key; ComponentLink6URL: https://datasheet.ciiva.com/2553/pyu-r-int-thick-7-2553254.pdf?src-supplier=Digi-Key; ComponentLink6Description: https://datasheet.ciiva.com/2553/pyu-r-int-thick-7-2553254.pdf?src-supplier=Digi-Key; ComponentLink7URL: https://datasheet.ciiva.com/12666/pyu-rc0402-51-rohs-l-6-r-12666952.pdf?src-supplier=Mouser; ComponentLink7Description: https://datasheet.ciiva.com/12666/pyu-rc0402-51-rohs-l-6-r-12666952.pdf?src-supplier=Mouser
U3 = CMP-02051-1: LED Driver IC 6 Output DC DC Regulator Step-Up (Boost) Analog, I²C, PWM Dimming 50mA 20-QFN (3x4); Manufacturer: Renesas; Interface IC Type: LED DISPLAY DRIVER; Internal Switch(s): Yes; Number of Outputs: 6; Voltage - Supply (Min): 4.5V; Voltage - Supply (Max): 26.5V; Voltage - Output: 40V; Frequency: 600kHz, 1.2MHz; JESD-609 Code: e3; REACH SVHC: Yes; RoHS Compliant: Yes; Terminal Finish: Tin; Series: Automotive, AEC-Q100; Type: DC DC Regulator; Topology: Step-Up (Boost); Current - Output / Channel: 50mA; Dimming: Analog, I²C, PWM; Applications: Automotive, Backlight; Operating Temperature: -40°C ~ 105°C (TA); Mounting Type: Surface Mount; Package / Case: 20-VFQFN Exposed Pad; Supplier Device Package: 20-QFN (3x4); Manufacturer Part Number: ISL78171ARZ-T7A
U4 = CMP-02068-1: Single I2C/SMBus Address Translator; Manufacturer: Analog Devices / Linear Technology; Interface IC Type: INTERFACE CIRCUIT; Max Supply Voltage: 5.5V; Min Supply Voltage: 2.25V; Number of Functions: 1; Package Body Material: Plastic; Supply Voltage-Nom: 3.3V; Height - Seated (Max): 0.8mm; JESD-30 Code: S-PDSO-N10; Length: 3mm; Max Operating Temperature: 85°C; Min Operating Temperature: -40°C; Number of Pins: 10; Package Code: VSON; Package Shape: Square; Package Style: SMALL OUTLINE, VERY THIN PROFILEMeter; REACH SVHC: Yes; RoHS Compliant: Yes; Surface Mount: Yes; Technology: CMOS; Temperature Grade: INDUSTRIAL; Terminal Form: No Lead; Terminal Pitch: 0.5mm; Terminal Position: DUAL; Width: 3mm; Supplier 1: Digi-Key; Supplier Part Number 1: 505-LTC4316IDD#TRPBFDKR-ND; Manufacturer Part Number: LTC4316IDD#TRPBF; RoHS: Yes; Category: Interface ICs; Stock 1: 531; Pricing 1: 1=5.70000, 10=5.12100, 25=4.84160, 100=4.19600, 250=3.98084, 500=3.57198, 1000=3.04500 (USD); ComponentLink1URL: https://datasheet.ciiva.com:443/pdfs/VipMasterIC/IC/LITC/LITC-S-A0001226702/LITC-S-A0001226702-1.pdf?src-supplier=IHS+Markit; ComponentLink1Description: https://datasheet.ciiva.com:443/pdfs/VipMasterIC/IC/LITC/LITC-S-A0001226702/LITC-S-A0001226702-1.pdf?src-supplier=IHS+Markit; ComponentLink2URL: http://www.linear.com/docs/46527?src-supplier=Digi-Key; ComponentLink2Description: http://www.linear.com/docs/46527?src-supplier=Digi-Key